# EAGLE design spoke (EAGLE 6.5.0)
CNAME: Aurai; CREVISION: 2; DESIGNER: Thomas Rix
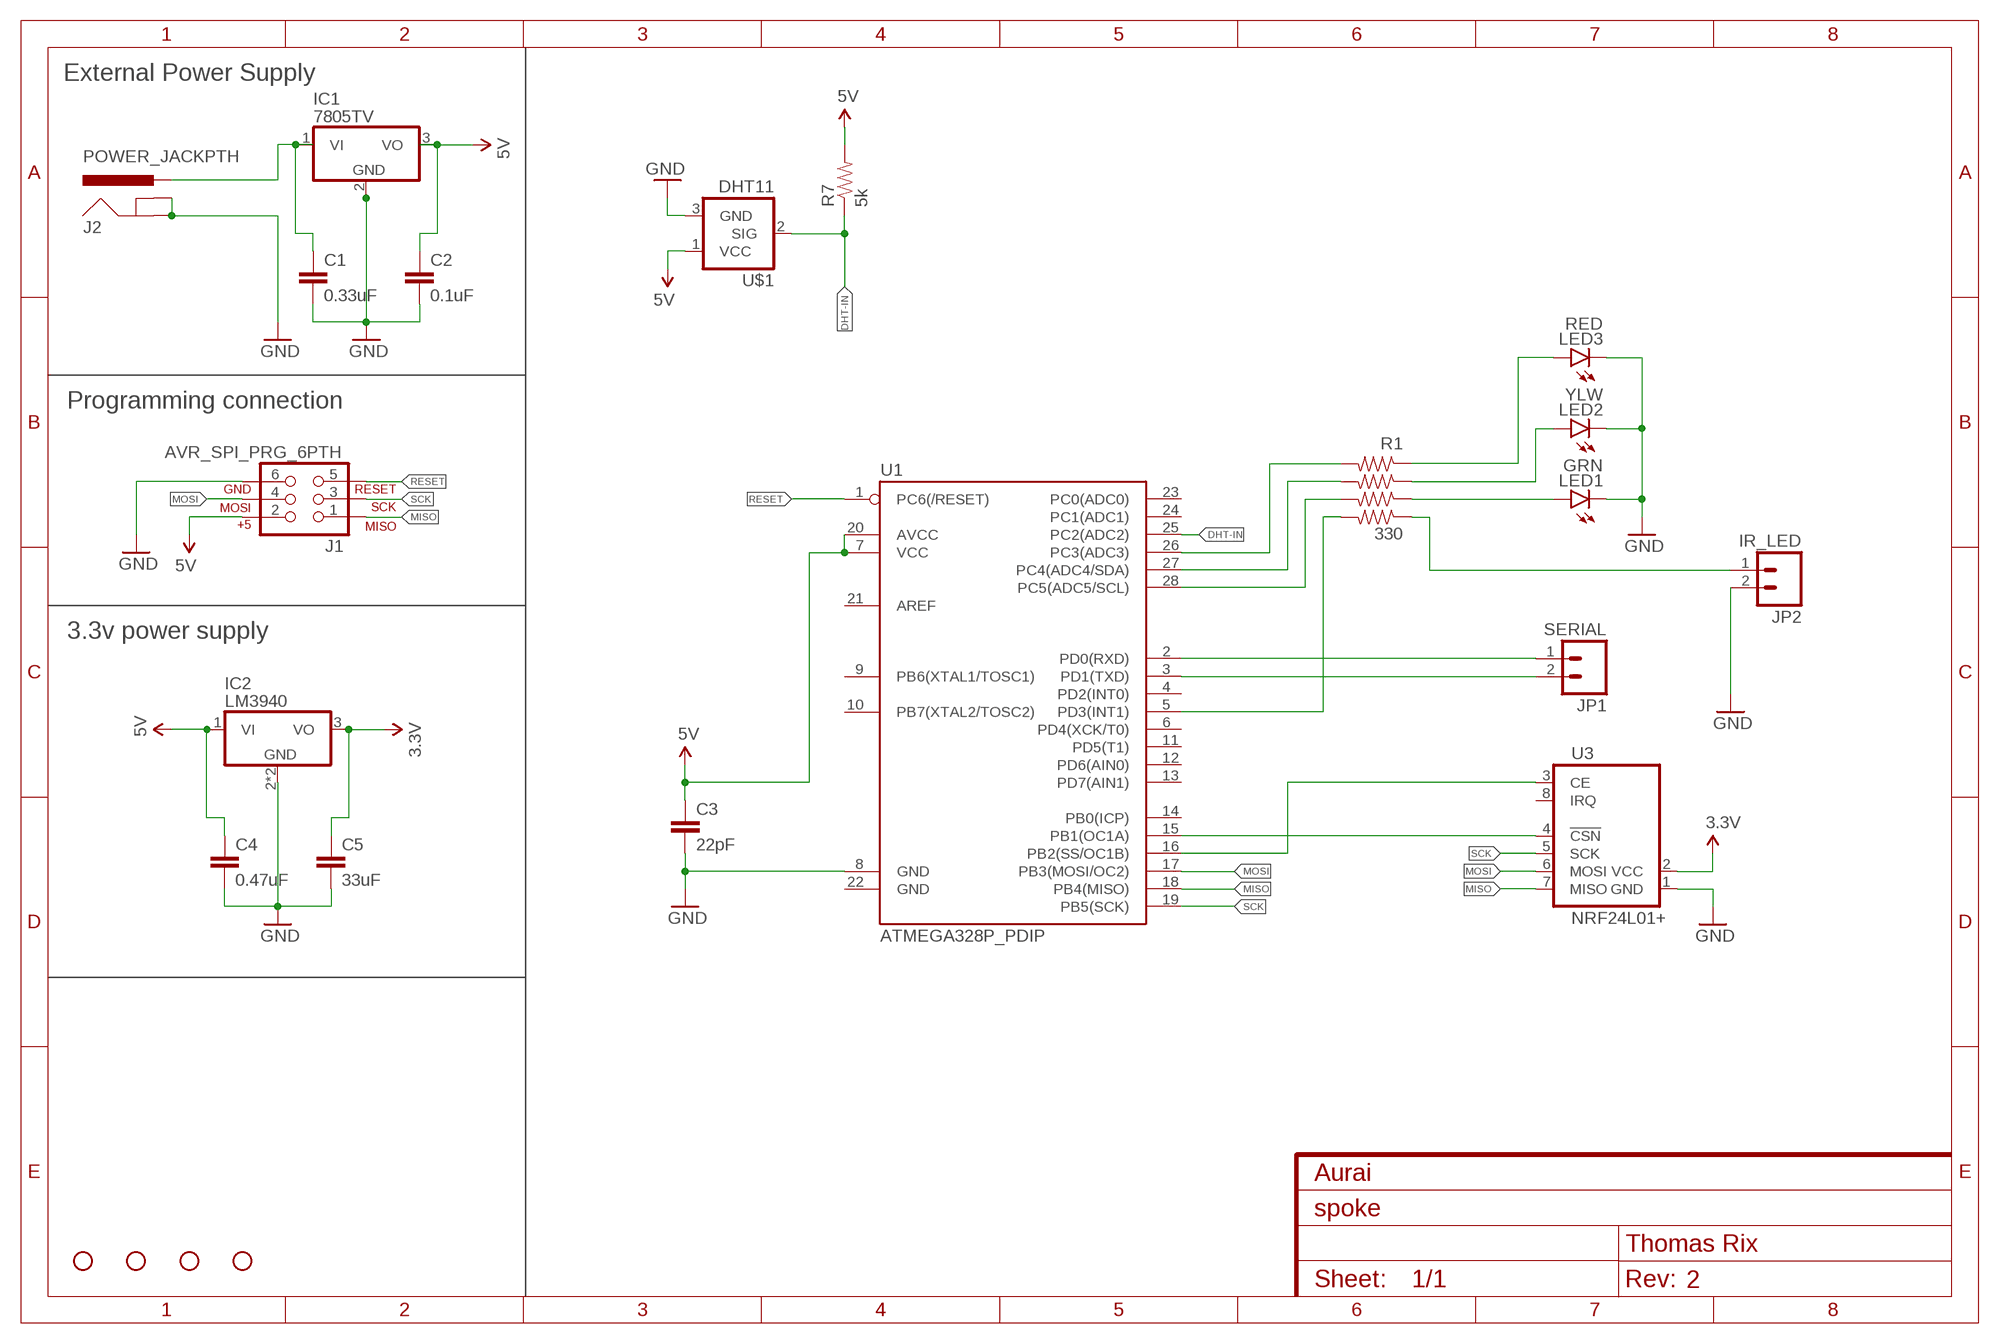
[diagram p0: schematic, sheet 1]

## Parts
C1  0.33uF  CAP0805  [0805]
C2  0.1uF  CAP0805  [0805]
C3  22pF  CAP0805  [0805]
C4  0.47uF  CAP0805  [0805]
C5  33uF  CAP0805  [0805]
IC1  7805TV  [TO220V]
IC2  LM3940  [SOT223]
J1  AVR_SPI_PRG_6PTH  [2X3]
J2  POWER_JACKPTH  [POWER_JACK_PTH]
JP1  SERIAL  M02PTH  [1X02]
JP2  IR_LED  M02PTH  [1X02]
LED1  GRN  LED1206  [LED-1206]
LED2  YLW  LED1206  [LED-1206]
LED3  RED  LED1206  [LED-1206]
R1  330  CRA06ES08  [CRA06S08]
R7  5k  RESISTOR0805-RES  [0805]
STANDOFF1  STAND-OFF  [STAND-OFF]
STANDOFF2  STAND-OFF  [STAND-OFF]
STANDOFF3  STAND-OFF  [STAND-OFF]
STANDOFF4  STAND-OFF  [STAND-OFF]
U1  ATMEGA328P_PDIP  [DIL28-3]
U3  NRF24L01+  [NRF24L01_HEADER]
U$1  DHT11  [DHT11_HEADER]

## Nets
3.3V: C5.1 IC2.3(VO) U3.2(VCC)
5V: C2.1 C3.1 C4.1 IC1.3(VO) IC2.1(VI) J1.2 R7.2 U1.7(VCC) U1.20(AVCC) U$1.1(VCC)
DHT-IN: R7.1 U1.25(PC2(ADC2)) U$1.2(SIG)
GND: C1.2 C2.2 C3.2 C4.2 C5.2 IC1.2(GND) IC2.2(GND) IC2.4(GND) J1.6 J2.GND J2.GNDBREAK JP2.2 LED1.C LED2.C LED3.C U1.8(GND) U3.1(GND) U$1.3(GND)
MISO: J1.1 U1.18(PB4(MISO)) U3.7(MISO)
MOSI: J1.4 U1.17(PB3(MOSI/OC2)) U3.6(MOSI)
N$1: LED1.A R1.3(R3A)
N$2: JP1.1 U1.2(PD0(RXD))
N$3: R1.7(R2B) U1.27(PC4(ADC4/SDA))
N$4: JP1.2 U1.3(PD1(TXD))
N$5: R1.8(R1B) U1.26(PC3(ADC3))
N$6: LED3.A R1.1(R1A)
N$7: U1.15(PB1(OC1A)) U3.4(!CSN)
N$8: LED2.A R1.2(R2A)
N$9: U1.16(PB2(SS/OC1B)) U3.3(CE)
N$12: R1.6(R3B) U1.28(PC5(ADC5/SCL))
N$14: C1.1 IC1.1(VI) J2.PWR
N$15: JP2.1 R1.4(R4A)
N$16: R1.5(R4B) U1.5(PD3(INT1))
RESET: J1.5 U1.1(PC6(/RESET))
SCK: J1.3 U1.19(PB5(SCK)) U3.5(SCK)
Unconnected: U1.4(PD2(INT0)) U1.6(PD4(XCK/T0)) U1.9(PB6(XTAL1/TOSC1)) U1.10(PB7(XTAL2/TOSC2)) U1.11(PD5(T1)) U1.12(PD6(AIN0)) U1.13(PD7(AIN1)) U1.14(PB0(ICP)) U1.21(AREF) U1.22(GND) U1.23(PC0(ADC0)) U1.24(PC1(ADC1)) U3.8(IRQ)

## Notes on the sheet
- External Power Supply
- Programming connection
- 3.3v power supply

## Library data of the parts
C1 C2 C4 C5 = SparkFun-Capacitors:CAP: Capacitor Standard 0603 ceramic capacitor, and 0.1" leaded capacitor.
C3 = SparkFun-Passives:CAP: Capacitor Standard 0603 ceramic capacitor, and 0.1" leaded capacitor.
IC1 = linear:78*: Positive VOLTAGE REGULATOR Source: http://cache.national.com/ds/LM/LM78L05.pdf http://www.fairchildsemi.com/ds/LM/LM7805.pdf
IC2 = aurai:LM3940: LM3904 5v to 3.3v LDO
J1 = SparkFun-Connectors:AVR_SPI_PRG_6: AVR ISP 6 Pin This is the reduced ISP connector for AVR programming. Common on Arduino. This footprint will take up less PCB space and can be used with a 10-pin to 6-pin adapter such as SKU: BOB-08508 **Special note about "TEST_POINT" package. The stop mask is on the top side, so if you want your programming test points to be on the bottom of your board, make sure to place this package on the bottom side of the board. This also ensure that the orientation to program from the bottom side will be correct.
J2 = SparkFun-Connectors:POWER_JACK: Power Jack This is the standard 5.5mm barrel jack for power. The PTH is the most common, proven, reliable, footprint. The Slot footprint only works if the mill layer is transmitted to the PCB fab house so be warned. Mating wall wart : TOL-00298 (and others); PROD_ID: PRT-00119
JP1 JP2 = SparkFun-Connectors:M02: Standard 2-pin 0.1" header. Use with - straight break away headers ( PRT-00116) - right angle break away headers (PRT-00553) - swiss pins (PRT-00743) - machine pins (PRT-00117) - female headers (PRT-00115) Molex polarized connector foot print use with: PRT-08233 with associated crimp pins and housings. 2.54_SCREWTERM for use with PRT-10571. 3.5mm Screw Terminal footprints for PRT-08084 5mm Screw Terminal footprints for use with PRT-08433
LED1-LED3 = SparkFun-LED:LED: LEDs Standard schematic elements and footprints for 5mm, 3mm, 1206, and 0603 sized LEDs. 5mm - Spark Fun Electronics SKU : COM-00529 (and others)
R1 = aurai:CRA06ES08
R7 = SparkFun-Resistors:RESISTOR: Resistor Basic schematic elements and footprints for 0603, 1206, and PTH resistors.
STANDOFF1-STANDOFF4 = SparkFun-Electromechanical:STAND-OFF: #4 Stand Off This is the mechanical footprint for a #4 phillips button head screw. Use the keepout ring to avoid running the screw head into surrounding components. SKU : PRT-00447
U1 = SparkFun-DigitalIC:ATMEGA328P_PDIP: uC used in the Arduino 32kb flash, 1k EEPROM, 2k SRAM This is the through-hole version of this chip.
U3 = aurai:NRF24L01+
U$1 = aurai:DHT11

## Board
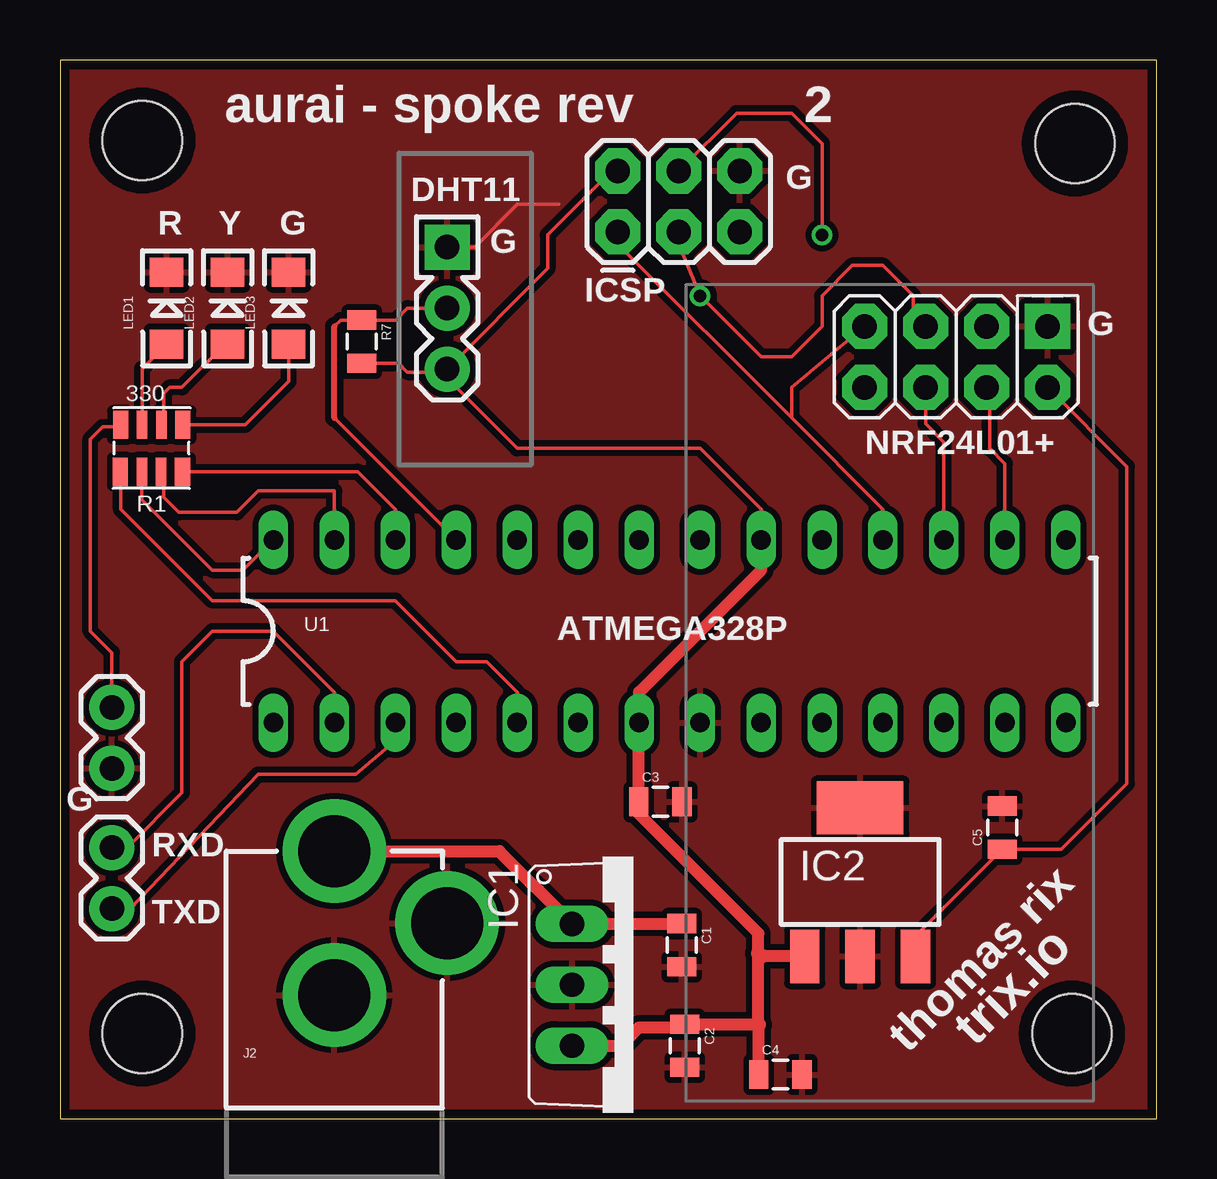
[diagram p1: board, top side]
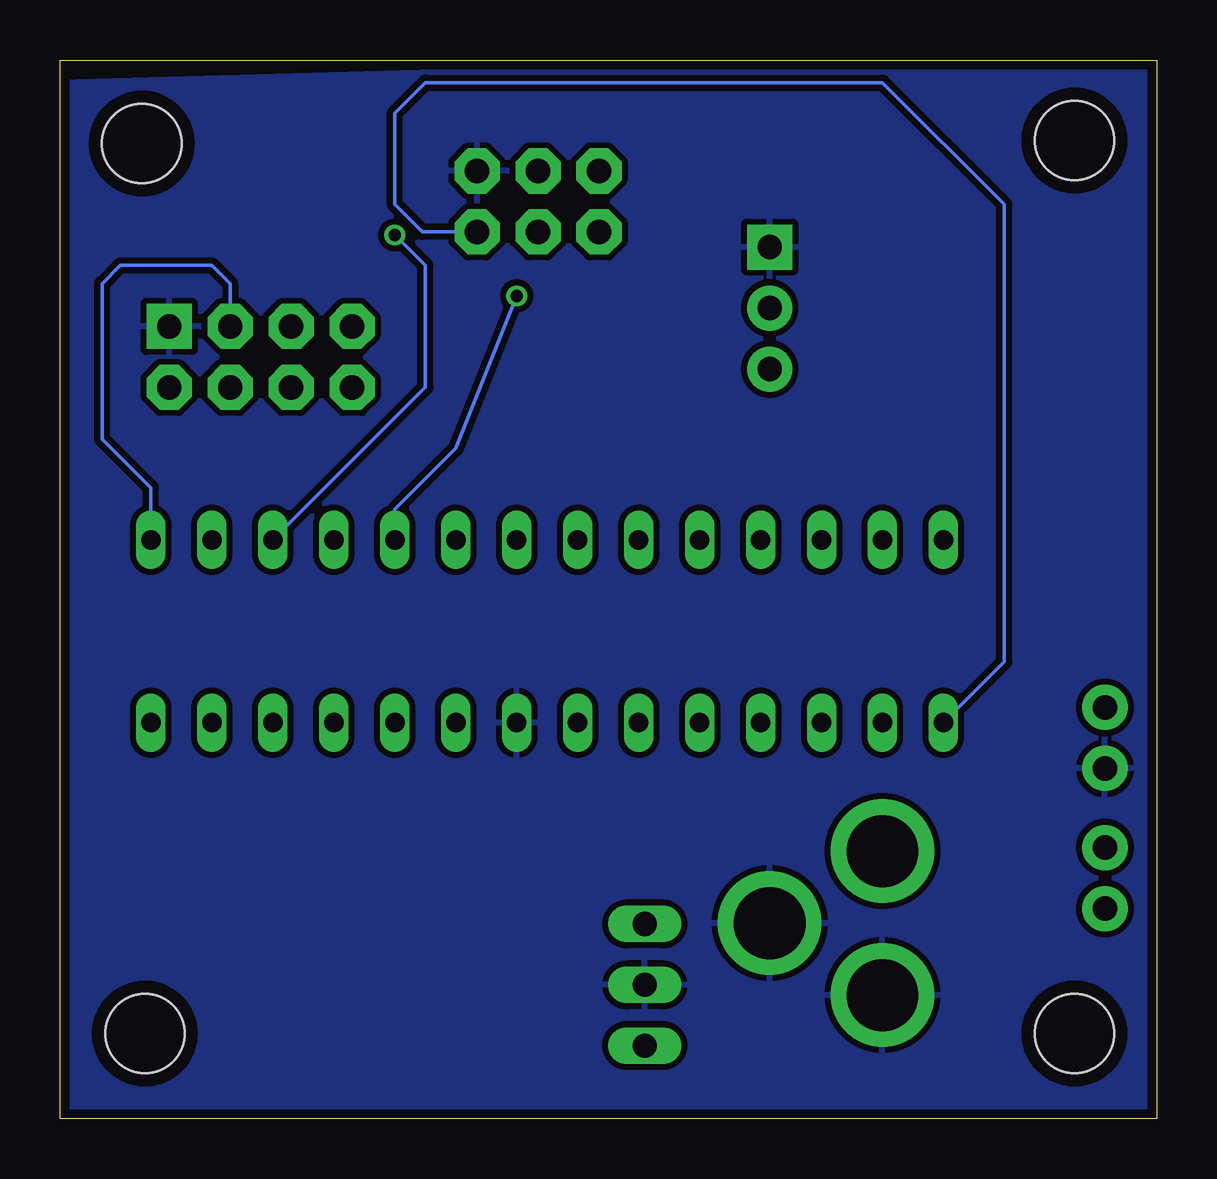
[diagram p2: board, bottom side, seen from below]

Size 45.7 x 44.12 mm. Coordinates in mm from the lower left corner, seen from the top.
Outline: 0,0 45.7,0 45.7,44.12 0,44.12 0,0
Copper layers (1*16): Top 0.0356mm / dielectric 1.5011mm / Bottom 0.0356mm
Design rules "LaenPCBOrder": minimum track width 6mil, minimum drill 13mil, track to track 6mil, track to pad 6mil, pad to pad 6mil, via to via 6mil, smd to smd 6mil, copper to edge 15mil, drill to drill 6mil, minimum pad ring 7mil, minimum via ring 7mil, stop-mask expansion 3mil, vias tented up to drill 0mil, thermal gap 10mil

### Footprints (pad centres in the part's own frame; a part is rotated, then mirrored left to right if it is on the bottom)
0805 = smd 0.8 x 1.2: 1 -0.9,0; 2 0.9,0
TO220V = drill 1.016 long: 1 -2.54,-2.54; 2 0,-2.54; 3 2.54,-2.54
SOT223 = smd 1.219 x 2.235: 1 -2.311,-3.099; 2 0,-3.099; 3 2.311,-3.099 | smd 3.6 x 2.2: 4 0,3.099
2X3 = drill 1.016 pad 1.88 octagon: 1 0,0; 2 0,2.54; 3 2.54,0; 4 2.54,2.54; 5 5.08,0; 6 5.08,2.54
POWER_JACK_PTH = drill 2.997 pad 4.318: GND 0,7.7; GNDBREAK 4.7,10.7; PWR 0,13.7
1X02 = drill 1.016 pad 1.88: 1 0,0; 2 2.54,0
LED-1206 = smd 1.2 x 1.4: A -1.5,0; C 1.5,0
CRA06S08 = smd 0.63 x 1.15: 1 -1.305,-0.98; 4 1.285,-0.98; 5 1.295,0.975; 8 -1.295,0.975 | smd 0.44 x 1.15: 2 -0.41,-0.98; 3 0.39,-0.98; 6 0.4,0.975; 7 -0.4,0.975
STAND-OFF = hole 3.302: 0,0
DIL28-3 = drill 0.813 long: 1 -16.51,-3.81; 2 -13.97,-3.81; 3 -11.43,-3.81; 4 -8.89,-3.81; 5 -6.35,-3.81; 6 -3.81,-3.81; 7 -1.27,-3.81; 8 1.27,-3.81; 9 3.81,-3.81; 10 6.35,-3.81; 11 8.89,-3.81; 12 11.43,-3.81; 13 13.97,-3.81; 14 16.51,-3.81; 15 16.51,3.81; 16 13.97,3.81; 17 11.43,3.81; 18 8.89,3.81; 19 6.35,3.81; 20 3.81,3.81; 21 1.27,3.81; 22 -1.27,3.81; 23 -3.81,3.81; 24 -6.35,3.81; 25 -8.89,3.81; 26 -11.43,3.81; 27 -13.97,3.81; 28 -16.51,3.81
NRF24L01_HEADER = drill 1.016 pad 1.88 square: 1 1.27,-5.08 | drill 1.016 pad 1.88 octagon: 2 -1.27,-5.08; 3 -1.27,-2.54; 4 1.27,-2.54; 5 1.27,0; 6 -1.27,0; 7 1.27,2.54; 8 -1.27,2.54
DHT11_HEADER = drill 1.016 pad 1.88: 1 0,0; 2 2.54,0 | drill 1.016 pad 1.88 square: 3 5.08,0

### Placement (x,y rotation side)
C1  25.91,7.24 270 top
C2  26.04,3.05 270 top
C3  25.02,13.21 0 top
C4  30.02,1.85 0 top
C5  39.26,12.14 90 top
IC1  23.88,5.59 270 top
IC2  33.34,9.87 0 top
J1  23.24,36.96 0 top
J2  11.43,-2.54 0 top
JP1  2.16,11.3 270 top
JP2  2.16,17.14 270 top
LED1  4.45,33.78 90 top
LED2  6.99,33.78 90 top
LED3  9.53,33.78 90 top
R1  3.81,27.94 180 top
R7  12.57,32.38 270 top
STANDOFF1  3.43,3.56 0 top
STANDOFF2  42.16,3.56 0 top
STANDOFF3  3.43,40.77 0 top
STANDOFF4  42.29,40.64 0 top
U1  25.4,20.32 0 top
U3  36.07,31.75 90 top
U$1  16.13,31.24 90 top

### Tracks (layer width: path | path; a pad name or v marks a point on that pad's centre or on a via)
3.3V
  Top 0.152: U3.2 44.45,27.18 44.45,13.97 41.72,11.24 C5.1 35.65,7.63 IC2.3
5V
  Top 0.152: 24.12,16.5 U1.7 | 24.13,12.7 24.13,13.2 C3.1 | R7.2 14.09,31.48 14.1,31.5 14.48,31.11 16,31.11 U$1.1 | U1.20 29.21,25.4 26.67,27.94 19.05,27.94 16.51,30.48 16.51,30.86 U$1.1 | J1.2 22.99,39.5 20.32,36.83 20.32,35.43 U$1.1
  Top 0.508: C3.1 24.12,16.5 | 24.13,12.7 25.4,11.43 29.1,7.73 29.1,6.9 29.1,3.95 C2.1 25.9,3.81 24.13,3.81 23.37,3.05 IC1.3 | U1.7 24.13,17.78 29.21,22.86 U1.20 | C4.1 29.12,3.93 | IC2.1 29.23,6.77
  Top 0.6: 29.12,3.93 29.1,3.95 | 29.23,6.77 29.1,6.9
DHT-IN
  Top 0.152: U$1.2 14.48,33.78 13.98,33.28 R7.1 11.7,33.28 11.43,33.02 | 11.43,29.21 U1.25
  Top 0.254: 11.43,29.21 11.43,33.02
GND
  Top 0.152: U$1.3 17.27,36.32 19.05,38.1 20.78,38.1
  pour Bottom (isolate 0.254): 0,0 0,44.45 45.72,43.18 45.72,0
  pour Top (isolate 0.254): 0,0 0,44.45 45.72,44.45 45.72,0
MISO
  Top 0.152: U1.18 34.29,25.4 30.48,29.21 | 30.48,29.21 30.48,30.48 U3.7 | J1.1 23.24,36.45 30.48,29.21
MOSI  (via drill 0.51)
  Top 0.152: 25.4,39.37 25.53,39.5 J1.4 28.19,41.91 30.48,41.91 31.75,40.64 v31.75,36.83 | U1.17 36.83,28.19 36.07,28.96 U3.6
  Bottom 0.152: U1.17 30.48,30.48 30.48,35.56 v31.75,36.83
N$1
  Top 0.152: R1.3 3.42,31.26 LED1.A
N$2
  Top 0.152: U1.2 11.43,17.78 8.89,20.32 6.35,20.32 5.08,19.05 5.08,13.59 2.79,11.3 JP1.1
N$3
  Top 0.152: U1.27 11.43,26.16 8.26,26.16 7.37,25.27 4.95,25.27 4.32,25.91 4.32,26.86 R1.7
N$4
  Top 0.152: JP1.2 2.92,8.76 8.26,14.35 12.32,14.35 13.97,15.75 U1.3
N$5
  Top 0.152: R1.8 12.4,26.96 13.97,25.4 U1.26
N$6
  Top 0.152: R1.1 7.71,28.92 9.53,30.73 LED3.A
N$7
  Bottom 0.152: U1.15 41.91,26.29 43.94,28.32 43.94,34.8 43.18,35.56 39.37,35.56 38.61,34.8 U3.4
N$8
  Top 0.152: LED2.A 6.88,32.28 5.08,30.48 4.57,30.48 4.32,30.23 4.32,29.02 R1.2
N$9
  Top 0.152: U1.16 39.37,27.3 38.73,27.94 38.73,30.35 U3.3
N$12
  Top 0.152: R1.6 3.41,25.8 6.35,22.86 7.62,22.86 U1.28
N$14
  Top 0.508: J2.PWR 18.3,11.16 IC1.1 25.9,8.13 C1.1
N$15
  Top 0.152: JP2.1 2.16,19.43 1.27,20.32 1.27,28.32 1.78,28.83 2.43,28.83 R1.4
N$16
  Top 0.152: U1.5 19.05,17.78 17.78,19.05 16.51,19.05 13.97,21.59 6.35,21.59 2.54,25.4 2.54,26.94 R1.5
RESET
  Bottom 0.152: U1.1 6.35,19.05 6.35,38.1 11.43,43.18 30.48,43.18 31.75,41.91 31.75,38.1 30.61,36.96 J1.5
SCK  (via drill 0.51)
  Top 0.152: J1.3 25.78,36.45 v26.67,34.29 29.21,31.75 30.48,31.75 31.75,33.02 31.75,34.29 33.02,35.56 34.29,35.56 35.56,34.29 35.56,33.53 U3.5
  Bottom 0.152: v26.67,34.29 29.21,27.94 31.75,25.4 U1.19

### Text on the board
tPlace: aurai - spoke rev | G | DHT11 | R | Y | G | G | ICSP | G | NRF24L01+ | ATMEGA328P | G | RXD | TXD | thomas rix | trix.io